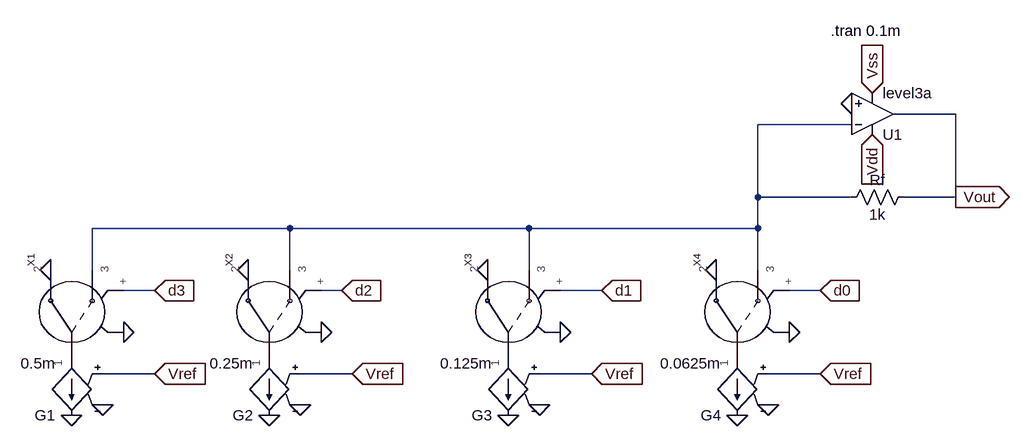
[diagram p0: schematic current_ladder4.asc]
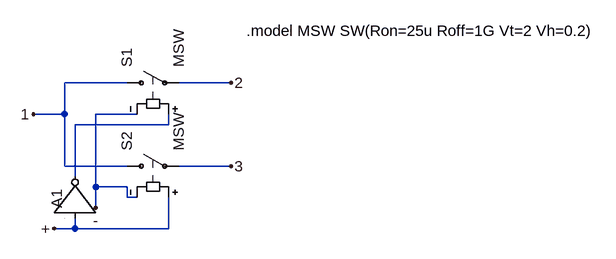
[diagram p1: sub-circuit spdt.asc]
current_ladder4.asc, the LTspice schematic file:
Version 4
SHEET 1 1256 1048
WIRE 1072 -304 976 -304
WIRE 912 -288 768 -288
WIRE 768 -176 768 -288
WIRE 912 -176 768 -176
WIRE 1072 -176 1072 -304
WIRE 1072 -176 992 -176
WIRE 48 -128 -256 -128
WIRE 416 -128 48 -128
WIRE 768 -128 768 -176
WIRE 768 -128 416 -128
WIRE -256 -64 -256 -128
WIRE 48 -64 48 -128
WIRE 416 -64 416 -128
WIRE 768 -64 768 -128
WIRE -160 -32 -208 -32
WIRE 128 -32 96 -32
WIRE 528 -32 464 -32
WIRE 864 -32 816 -32
WIRE -160 96 -240 96
WIRE 144 96 64 96
WIRE 512 96 432 96
WIRE 864 96 784 96
FLAG -320 -64 0
FLAG -16 -64 0
FLAG 352 -64 0
FLAG 704 -64 0
FLAG -208 32 0
FLAG 96 32 0
FLAG 464 32 0
FLAG 816 32 0
FLAG -288 160 0
FLAG 16 160 0
FLAG 384 160 0
FLAG 736 160 0
FLAG 912 -320 0
FLAG 944 -336 Vss
IOPIN 944 -336 In
FLAG 944 -272 Vdd
IOPIN 944 -272 In
FLAG 864 -32 d0
IOPIN 864 -32 In
FLAG 528 -32 d1
IOPIN 528 -32 In
FLAG 128 -32 d2
IOPIN 128 -32 In
FLAG -160 -32 d3
IOPIN -160 -32 In
FLAG 1072 -176 Vout
IOPIN 1072 -176 Out
FLAG 432 144 0
FLAG 784 144 0
FLAG 864 96 Vref
IOPIN 864 96 In
FLAG 512 96 Vref
IOPIN 512 96 In
FLAG 64 144 0
FLAG 144 96 Vref
IOPIN 144 96 In
FLAG -240 144 0
FLAG -160 96 Vref
IOPIN -160 96 In
SYMBOL SPDT -288 32 R270
SYMATTR InstName X1
SYMBOL SPDT 16 32 R270
SYMATTR InstName X2
SYMBOL SPDT 384 32 R270
SYMATTR InstName X3
SYMBOL SPDT 736 32 R270
SYMATTR InstName X4
SYMBOL res 1008 -192 R90
WINDOW 0 5 56 VBottom 2
WINDOW 3 27 56 VTop 2
SYMATTR InstName Rf
SYMATTR Value 1k
SYMBOL g2 -288 176 R180
SYMATTR InstName G1
SYMATTR Value 0.5m
SYMBOL g2 16 176 R180
SYMATTR InstName G2
SYMATTR Value 0.25m
SYMBOL g2 384 176 R180
SYMATTR InstName G3
SYMATTR Value 0.125m
SYMBOL g2 736 176 R180
SYMATTR InstName G4
SYMATTR Value 0.0625m
SYMBOL OpAmps\\UniversalOpAmp3 944 -304 M180
SYMATTR InstName U1
TEXT 880 -432 Left 2 !.tran 0.1m

spdt.asc, the sub-circuit schematic file:
Version 4
SHEET 1 932 680
WIRE 144 96 48 96
WIRE 304 96 224 96
WIRE 48 144 48 96
WIRE 48 144 0 144
WIRE 160 144 96 144
WIRE 208 160 208 144
WIRE 208 160 64 160
WIRE 48 224 48 144
WIRE 144 224 48 224
WIRE 304 224 224 224
WIRE 64 240 64 160
WIRE 96 256 96 144
WIRE 144 256 96 256
WIRE 144 272 144 256
WIRE 160 272 144 272
WIRE 96 288 96 256
WIRE 64 320 64 304
WIRE 64 320 32 320
WIRE 208 320 208 272
WIRE 208 320 64 320
FLAG 0 144 1
FLAG 304 96 2
FLAG 304 224 3
FLAG 32 320 +
FLAG 96 288 -
SYMBOL sw 128 96 R270
SYMATTR InstName S1
SYMATTR Value MSW
SYMBOL sw 128 224 R270
SYMATTR InstName S2
SYMATTR Value MSW
SYMBOL Digital\\inv 128 304 M270
WINDOW 3 8 60 Invisible 2
WINDOW 0 15 92 Left 2
SYMATTR Value td=10n Vhigh=5
SYMATTR InstName A1
TEXT 328 16 Left 2 !.model MSW SW(Ron=25u Roff=1G Vt=2 Vh=0.2)

The netlist it stands for:
* current_ladder4.asc
XX1 P001 0 N001 d3 0 spdt
XX2 P002 0 N001 d2 0 spdt
XX3 P003 0 N001 d1 0 spdt
XX4 P004 0 N001 d0 0 spdt
Rf Vout N001 1k
G1 P001 0 Vref 0 0.5m
G2 P002 0 Vref 0 0.25m
G3 P003 0 Vref 0 0.125m
G4 P004 0 Vref 0 0.0625m
XU1 0 N001 Vdd Vss Vout level3a  ; pins In+ In- V+ V- OUT

* block symbol definitions
.subckt spdt 1 2 3 + -
S1 1 2 N001 - MSW
S2 1 3 + - MSW
A1 + 0 0 0 0 N001 0 0 BUF td=10n Vhigh=5
.model MSW SW(Ron=25u Roff=1G Vt=2 Vh=0.2)
.ends spdt

.tran 0.1m
.backanno
.end